# Altium schematic sheet 06_POWER_MEASUREMENT.SchDoc
size 420 x 297 mm; SheetNumber: 6; SheetTotal: 27
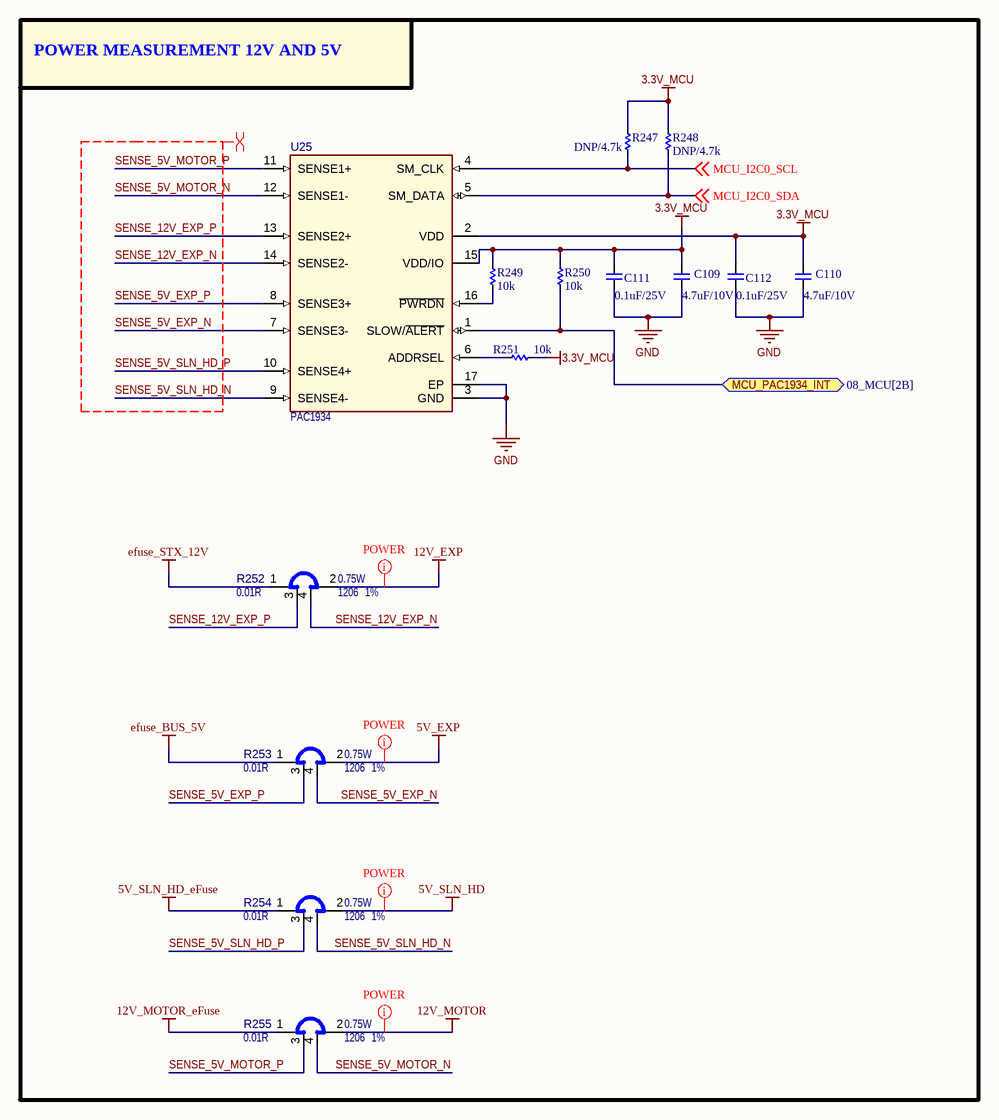
[diagram p0: 06_POWER_MEASUREMENT.SchDoc]

## Parts
C109  4.7uF/10V  [CAP_C_1005X60]
C110  4.7uF/10V  [CAP_C_1005X60]
C111  0.1uF/25V  [CAP_C_1005X60]
C112  0.1uF/25V  [CAP_C_1005X60]
R247  DNP/4.7k  [RES_C_1005X40]
R248  DNP/4.7k  [RES_C_1005X40]
R249  10k  [RES_C_1005X40]
R250  10k  [RES_C_1005X40]
R251  10k  [RES_C_1005X40]
R252  value 0.01R  Package: 1206  Tolerance: 1%  Power: 0.75W  [RES_C_1206_SHUNT]  (hidden comment: KRL1632E-M-R010-F-T5)
R253  value 0.01R  Package: 1206  Tolerance: 1%  Power: 0.75W  [RES_C_1206_SHUNT]  (hidden comment: KRL1632E-M-R010-F-T5)
R254  value 0.01R  Package: 1206  Tolerance: 1%  Power: 0.75W  [RES_C_1206_SHUNT]  (hidden comment: KRL1632E-M-R010-F-T5)
R255  value 0.01R  Package: 1206  Tolerance: 1%  Power: 0.75W  [RES_C_1206_SHUNT]  (hidden comment: KRL1632E-M-R010-F-T5)
U25  value PAC1934  [UQFN-16_4X4_EP2.6X2.6]  (hidden comment: PAC1934 UQFN-16)

## Blocks framed on the sheet
POWER MEASUREMENT 12V AND 5V: C109-C112 R247-R255 U25

## Ports
MCU_PAC1934_INT (bidir, see 08_MCU[2B])

## Nets
3.3V_MCU: C109.1 C110.1 C111.1 C112.1 R247.1 R248.1 R249.1 R250.1 R251.2 U25.2(VDD) U25.15(VDD/IO)
5V_EXP: R253.2
5V_SLN_HD: R254.2
5V_SLN_HD_eFuse: R254.1
12V_EXP: R252.2
12V_MOTOR: R255.2
12V_MOTOR_eFuse: R255.1
efuse_BUS_5V: R253.1
efuse_STX_12V: R252.1
GND: C109.2 C110.2 C111.2 C112.2 U25.3(GND) U25.17(EP)
MCU_I2C0_SCL: R247.2 U25.4(SM_CLK) ; off-sheet MCU_I2C0_SCL
MCU_I2C0_SDA: R248.2 U25.5(SM_DATA) ; off-sheet MCU_I2C0_SDA
MCU_PAC1934_INT: R250.2 U25.1(SLOW/~{ALERT}) ; port MCU_PAC1934_INT
SENSE_5V_EXP_N: R253.4 U25.7(SENSE3-)
SENSE_5V_EXP_P: R253.3 U25.8(SENSE3+)
SENSE_5V_MOTOR_N: R255.4 U25.12(SENSE1-)
SENSE_5V_MOTOR_P: R255.3 U25.11(SENSE1+)
SENSE_5V_SLN_HD_N: R254.4 U25.9(SENSE4-)
SENSE_5V_SLN_HD_P: R254.3 U25.10(SENSE4+)
SENSE_12V_EXP_N: R252.4 U25.14(SENSE2-)
SENSE_12V_EXP_P: R252.3 U25.13(SENSE2+)
NetR249_2: R249.2 U25.16(~{PWRDN})
NetR251_1: R251.1 U25.6(ADDRSEL)

## Layout directives
differential pair: SENSE_5V_EXP_N, SENSE_5V_EXP_P, SENSE_5V_MOTOR_N, SENSE_5V_MOTOR_P, SENSE_5V_SLN_HD_N, SENSE_5V_SLN_HD_P, SENSE_12V_EXP_N, SENSE_12V_EXP_P
net class POWER: 5V_EXP, 5V_SLN_HD, 12V_EXP, 12V_MOTOR

## Notes on the sheet
- Project
- Sub-system:
- Design by:
- Sheet title:
- Sheet:
- of
- Checked by:
- Approved by:
- Doc no:
- Revision
- Size:
- Date:

## Library data of the parts
C109-C112 = _CAP_C_2: CAP
R247-R251 = _RES_B_2: RES
R252-R255 = RSMT1316: Shunt; Manufacturer 1: SUSUMU; Description_: RES SHUNT MF 0.01R 1% 0.75W SMD 1206; Dev Tools Status: Design; Temperature Coeffcient: 50ppm/C; Current: 8A; Owner: Ciprian Abramov; Populated: YES; MCHP-ID: RSMT1316; Revision: 1; Symbol: Shunt 4 Pin; Status: MCL Design; ComponentLink1URL: https://chn-vm-apps.microchip.com/mchprepo/parts/Datasheets/n_catalog_partition09_en.pdf; ComponentLink1Description: SVN Datasheet; ComponentLink2URL: C:\ALTIUM_WORK\00001_MCHP-CDB\Datasheets\n_catalog_partition09_en.pdf; ComponentLink2Description: Local Datasheet; ComponentLink3URL: C:\ALTIUM_WORK\00001_MCHP-CDB\Library\LibraryRefs\Shunt 4 Pin.SchLib; ComponentLink3Description: Open Symbol; ComponentLink4URL: C:\ALTIUM_WORK\00001_MCHP-CDB\Library\Footprints\RES_C_1206_SHUNT.PcbLib; ComponentLink4Description: Open Footprint; ComponentLink5Description: Open Footprint 2; ComponentLink6Description: Open Footprint 3; ComponentLink7Description: Open Footprint 4; Operating Temperature: -55C to +155C; Category: Resistor; Type: RES SMD; Composition: MF; Manufacturer Part Number 1: KRL1632E-M-R010-F-T5; Supplier 1: Digi-Key; Supplier Part Number 1: 408-1570-1-ND; Quantity Override: 1
U25 = MIC8883: Manufacturer 1: Microchip Technology; Manufacturer Part Number 1: PAC1934T-I/JQ; Description_: MCHP ANALOG POWER CURRENT SENSE MONITOR PAC1934T-I/JQ UQFN-16; Dev Tools Status: Design; Owner: Ciprian Abramov; Populated: YES; MCHP-ID: MIC8883; Symbol: PAC1934 UQFN-16; Type: Power/Current Sensor; Status: MCL Design; Revision: 1; Category: MCHP-Analog; ComponentLink1Description: SVN Datasheet; ComponentLink2Description: Local Datasheet; ComponentLink3URL: C:\ALTIUM_WORK\00001_MCHP-CDB\Library\LibraryRefs\PAC1934 UQFN-16.SchLib; ComponentLink3Description: Open Symbol; ComponentLink4URL: C:\ALTIUM_WORK\00001_MCHP-CDB\Library\Footprints\UQFN-16_4X4_EP2.6X2.6.PcbLib; ComponentLink4Description: Open Footprint; ComponentLink5Description: Open Footprint 2; ComponentLink6Description: Open Footprint 3; ComponentLink7Description: Open Footprint 4; Supplier 1: Digi-Key; Supplier Part Number 1: PAC1934T-I/JQCT-ND; Quantity Override: 1